# Altium schematic sheet Thermistor Connections.SchDoc
size A
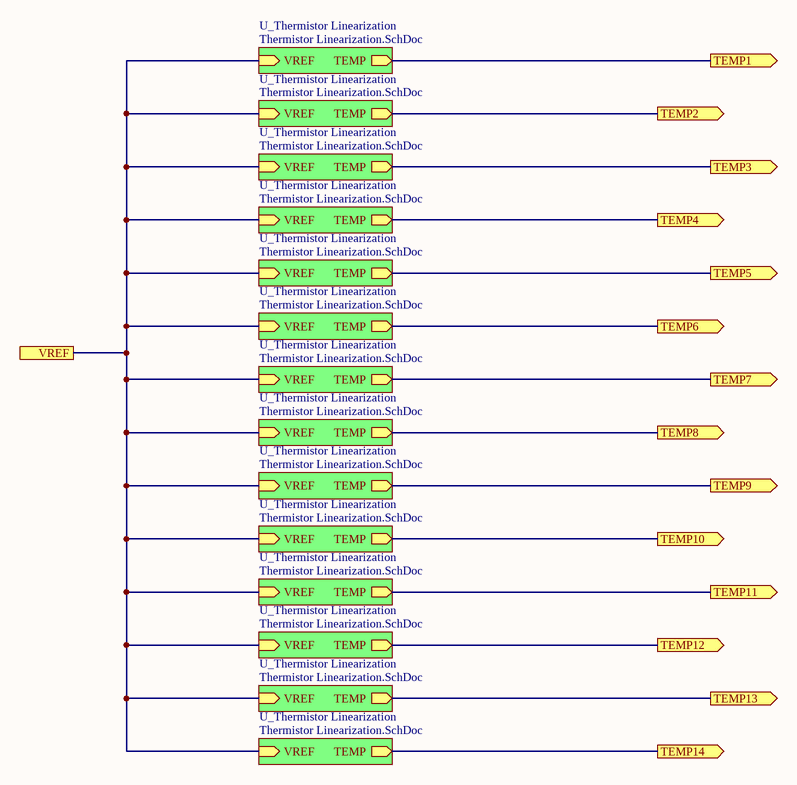
[diagram p0: Thermistor Connections.SchDoc]

## Sub-sheets
U_Thermistor Linearization = Thermistor Linearization.SchDoc: VREF (in), TEMP (out)
U_Thermistor Linearization = Thermistor Linearization.SchDoc: VREF (in), TEMP (out)
U_Thermistor Linearization = Thermistor Linearization.SchDoc: VREF (in), TEMP (out)
U_Thermistor Linearization = Thermistor Linearization.SchDoc: VREF (in), TEMP (out)
U_Thermistor Linearization = Thermistor Linearization.SchDoc: VREF (in), TEMP (out)
U_Thermistor Linearization = Thermistor Linearization.SchDoc: VREF (in), TEMP (out)
U_Thermistor Linearization = Thermistor Linearization.SchDoc: VREF (in), TEMP (out)
U_Thermistor Linearization = Thermistor Linearization.SchDoc: VREF (in), TEMP (out)
U_Thermistor Linearization = Thermistor Linearization.SchDoc: VREF (in), TEMP (out)
U_Thermistor Linearization = Thermistor Linearization.SchDoc: VREF (in), TEMP (out)
U_Thermistor Linearization = Thermistor Linearization.SchDoc: VREF (in), TEMP (out)
U_Thermistor Linearization = Thermistor Linearization.SchDoc: VREF (in), TEMP (out)
U_Thermistor Linearization = Thermistor Linearization.SchDoc: VREF (in), TEMP (out)
U_Thermistor Linearization = Thermistor Linearization.SchDoc: VREF (in), TEMP (out)

## Ports
TEMP1 (out), TEMP2 (out), TEMP3 (out), TEMP4 (out), TEMP5 (out), TEMP6 (out), TEMP7 (out), TEMP8 (out), TEMP9 (out), TEMP10 (out), TEMP11 (out), TEMP12 (out), TEMP13 (out), TEMP14 (out), VREF

## Nets
TEMP1: port TEMP1, sheet U_Thermistor Linearization/TEMP
TEMP2: port TEMP2, sheet U_Thermistor Linearization/TEMP
TEMP3: port TEMP3, sheet U_Thermistor Linearization/TEMP
TEMP4: port TEMP4, sheet U_Thermistor Linearization/TEMP
TEMP5: port TEMP5, sheet U_Thermistor Linearization/TEMP
TEMP6: port TEMP6, sheet U_Thermistor Linearization/TEMP
TEMP7: port TEMP7, sheet U_Thermistor Linearization/TEMP
TEMP8: port TEMP8, sheet U_Thermistor Linearization/TEMP
TEMP9: port TEMP9, sheet U_Thermistor Linearization/TEMP
TEMP10: port TEMP10, sheet U_Thermistor Linearization/TEMP
TEMP11: port TEMP11, sheet U_Thermistor Linearization/TEMP
TEMP12: port TEMP12, sheet U_Thermistor Linearization/TEMP
TEMP13: port TEMP13, sheet U_Thermistor Linearization/TEMP
TEMP14: port TEMP14, sheet U_Thermistor Linearization/TEMP
VREF: port VREF, sheet U_Thermistor Linearization/VREF, sheet U_Thermistor Linearization/VREF, sheet U_Thermistor Linearization/VREF, sheet U_Thermistor Linearization/VREF, sheet U_Thermistor Linearization/VREF, sheet U_Thermistor Linearization/VREF, sheet U_Thermistor Linearization/VREF, sheet U_Thermistor Linearization/VREF, sheet U_Thermistor Linearization/VREF, sheet U_Thermistor Linearization/VREF, sheet U_Thermistor Linearization/VREF, sheet U_Thermistor Linearization/VREF, sheet U_Thermistor Linearization/VREF, sheet U_Thermistor Linearization/VREF